# EasyEDA schematic SCH_练习音响_2023-03-02.json
TITLE: Sheet_1; REV: 1.0; Date: 2023-02-19; Sheet: 1/1; Drawn By: CQT-LINFENG; Company: Your Company
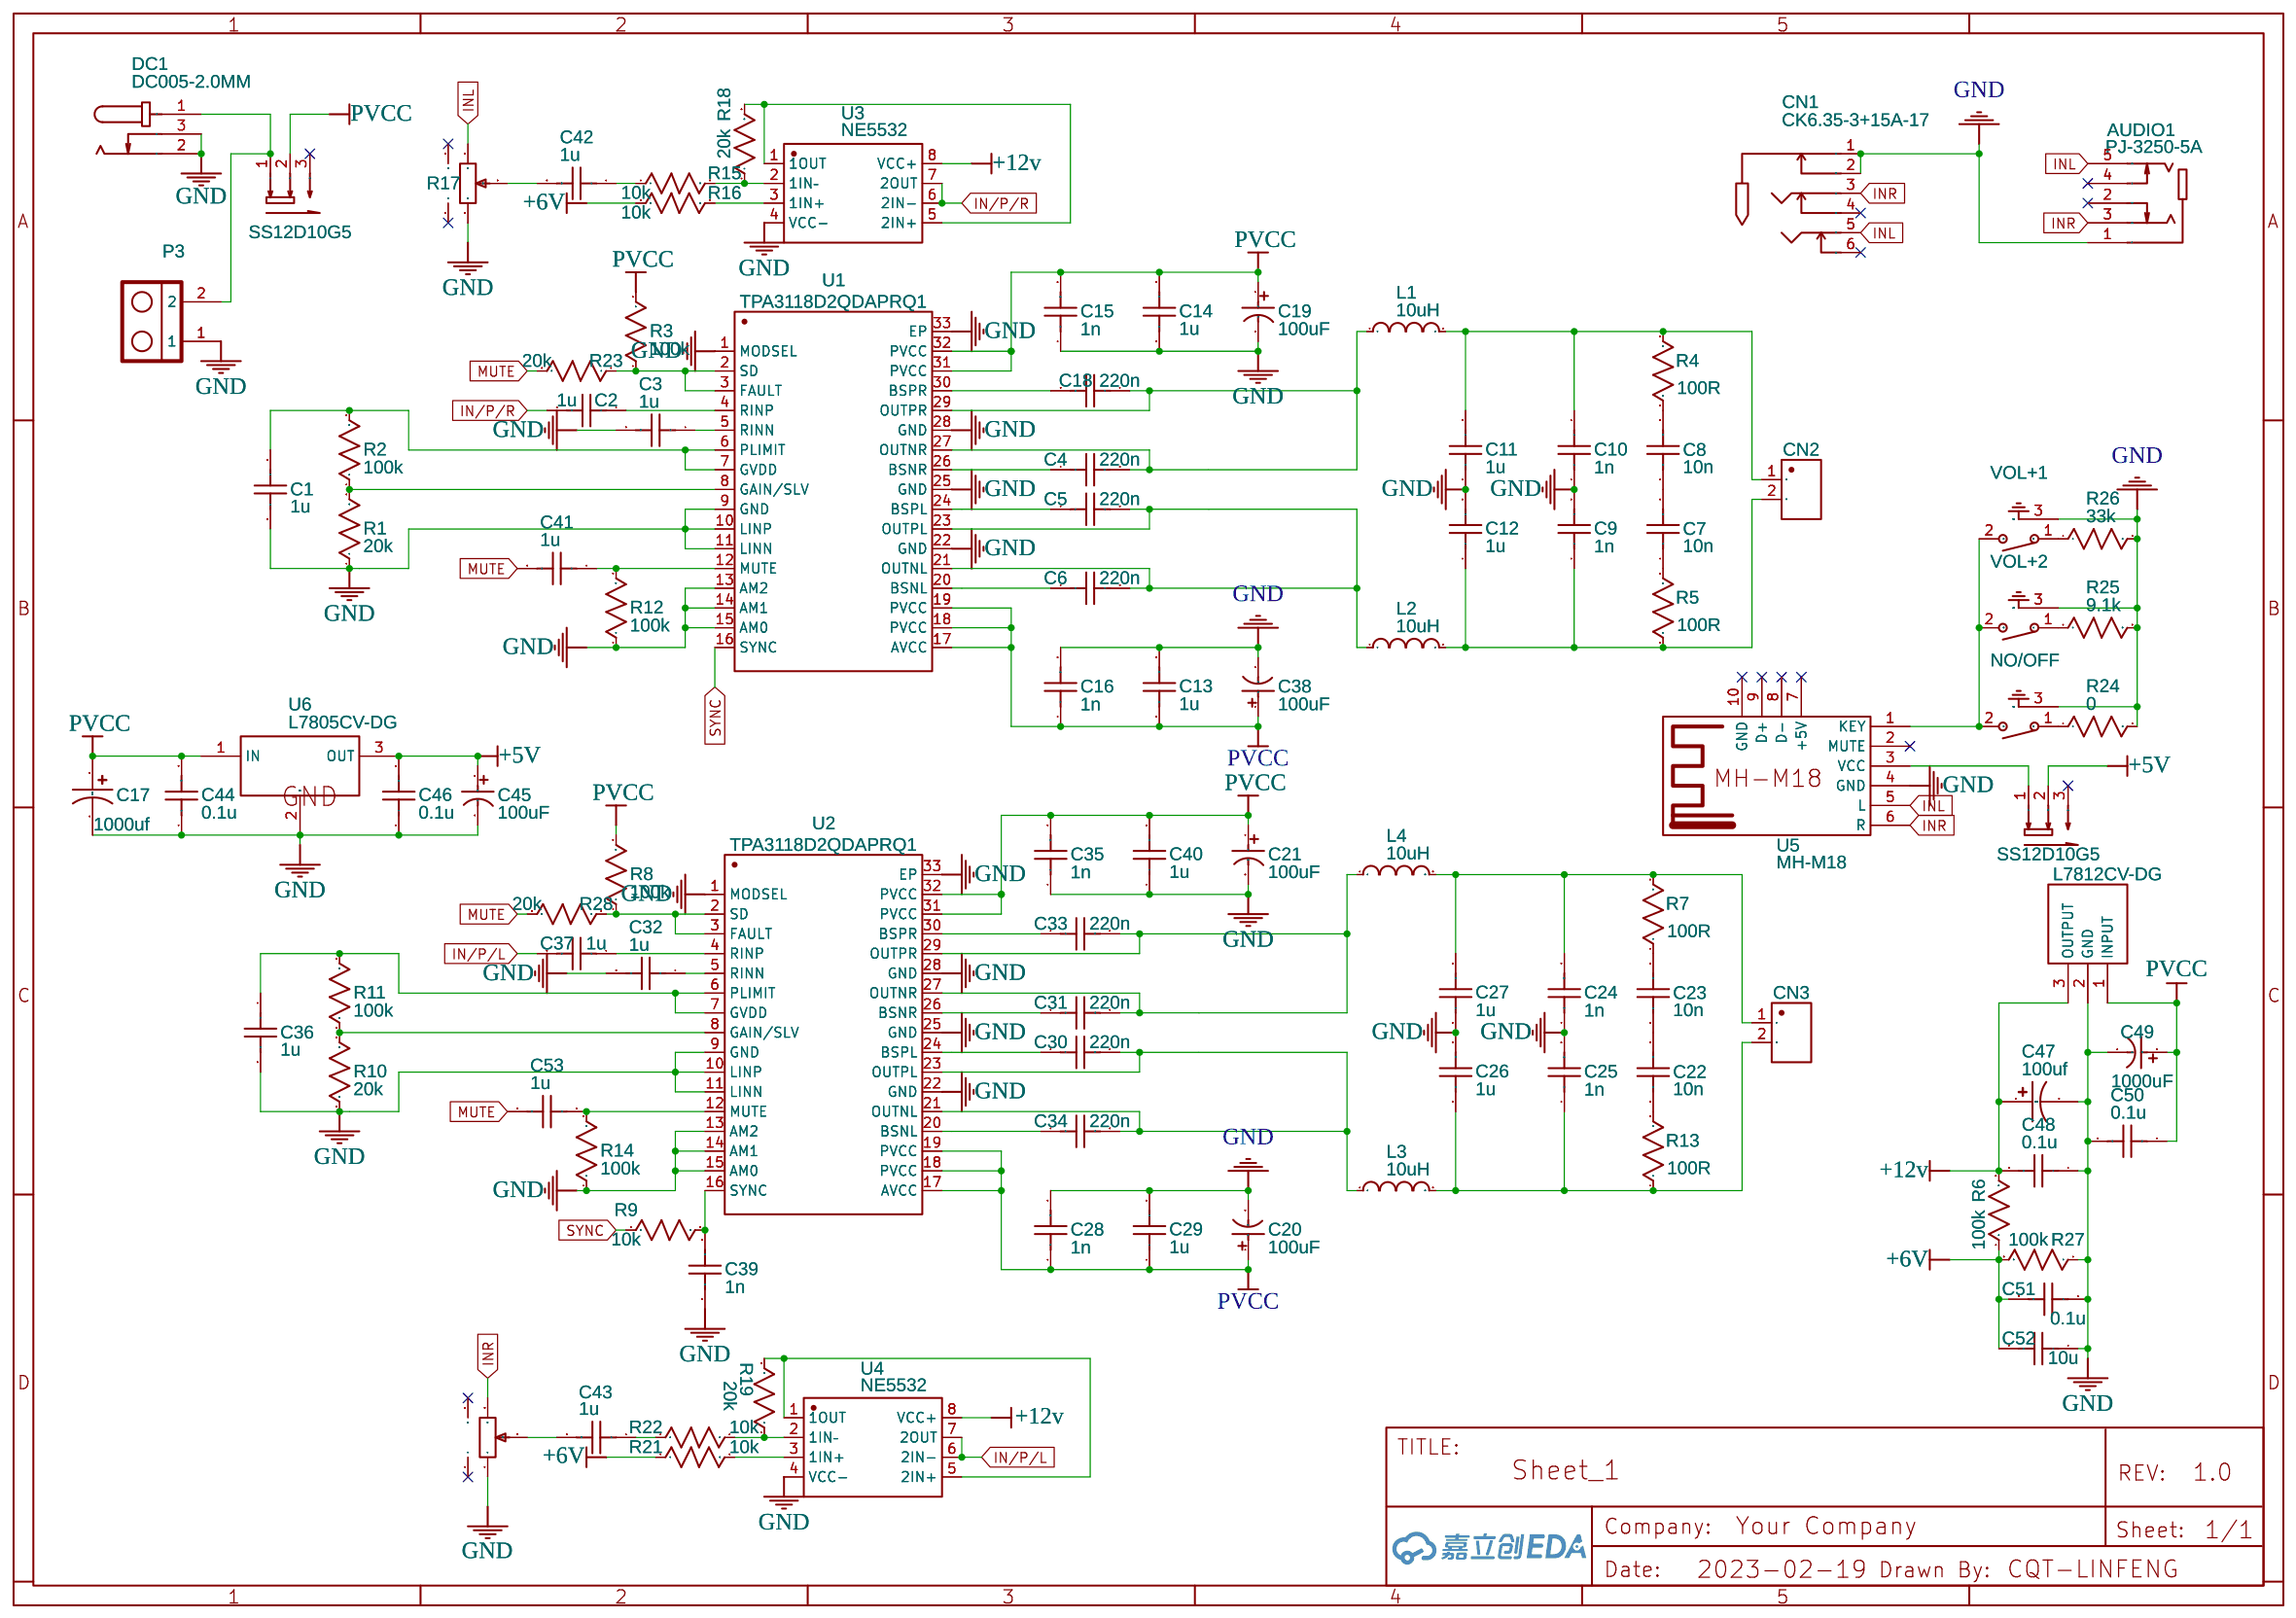
[diagram p0: schematic sheet]

## Parts
AUDIO1  PJ-3250-5A  [AUDIO-TH_PJ-3250-5A]
C1  1u  [C0402]
C2  1u  [C0402]
C3  1u  [C0402]
C4  220n  [C0402]
C5  220n  [C0402]
C6  220n  [C0402]
C7  10n  [C0402]
C8  10n  [C0402]
C9  1n  [C0402]
C10  1n  [C0402]
C11  1u  [C0402]
C12  1u  [C0402]
C13  1u  [C0402]
C14  1u  [C0402]
C15  1n  [C0402]
C16  1n  [C0402]
C17  1000uf  [CAP-D6.3×H5.5]
C18  220n  [C0603]
C19  100uF  [CAP-TH_BD6.3-P2.50-D1.0-FD]
C20  100uF  [CAP-TH_BD6.3-P2.50-D1.0-FD]
C21  100uF  [CAP-TH_BD6.3-P2.50-D1.0-FD]
C22  10n  [C0402]
C23  10n  [C0402]
C24  1n  [C0402]
C25  1n  [C0402]
C26  1u  [C0402]
C27  1u  [C0402]
C28  1n  [C0402]
C29  1u  [C0402]
C30  220n  [C0402]
C31  220n  [C0402]
C32  1u  [C0402]
C33  220n  [C0402]
C34  220n  [C0402]
C35  1n  [C0402]
C36  1u  [C0402]
C37  1u  [C0402]
C38  100uF  [CAP-TH_BD6.3-P2.50-D1.0-FD]
C39  1n  [C0402]
C40  1u  [C0402]
C41  1u  [C0402]
C42  1u  [C0402]
C43  1u  [C0402]
C44  0.1u  [C0402]
C45  100uF  [CAP-TH_BD6.3-P2.50-D1.0-FD]
C46  0.1u  [C0402]
C47  100uf  [CAP-D6.3×H5.5]
C48  0.1u  [C0402]
C49  1000uF  [CAP-TH_BD6.3-P2.50-D1.0-FD]
C50  0.1u  [C0402]
C51  0.1u  [C0402]
C52  10u  [C0402]
C53  1u  [C0402]
CN1  CK6.35-3+15A-17  [AUDIO-TH_CK6.35-3-15A-17]
CN2  A2002WV-2P  [CONN-TH_A2002WV-2P]
CN3  A2002WV-2P  [CONN-TH_A2002WV-2P]
DC1  DC005-2.0MM  [DC-IN-TH_DC005]
L1  10uH  [IND-SMD_L10.4-W10.3]
L2  10uH  [IND-SMD_L10.4-W10.3]
L3  10uH  [IND-SMD_L10.4-W10.3]
L4  10uH  [IND-SMD_L10.4-W10.3]
NO/OFF  侧按键  [侧按键]
P3  端子2P KF128_2  5.08端子-2   PCB端子  [5.08端子-2   PCB端子]
R1  20k  [R0402]
R2  100k  [R0402]
R3  100k  [R0402]
R4  100R  [R0402]
R5  100R  [R0402]
R6  100k  [R0603]
R7  100R  [R0402]
R8  100k  [R0402]
R9  10k  [R0402]
R10  20k  [R0402]
R11  100k  [R0402]
R12  100k  [R0402]
R13  100R  [R0402]
R14  100k  [R0402]
R15  10k  [R0402]
R16  10k  [R0402]
R17  RV09AF-40-15K-B10K-0C  [RES-ADJ-TH_RV09]
R18  20k  [R0402]
R19  20k  [R0402]
R20  RV09AF-40-15K-B10K-0C  [RES-ADJ-TH_RV09]
R21  10k  [R0402]
R22  10k  [R0402]
R23  20k  [R0402]
R24  0  [R0402]
R25  9.1k  [R0402]
R26  33k  [R0402]
R27  100k  [R0603]
R28  20k  [R0402]
SW1  SS12D10G5  [SS12D10G5]
SW2  SS12D10G5  [SS12D10G5]
U1  TPA3118D2QDAPRQ1  [HTSSOP-32_L11.0-W6.1-P0.65-LS8.1-BL-EP]
U2  TPA3118D2QDAPRQ1  [HTSSOP-32_L11.0-W6.1-P0.65-LS8.1-BL-EP]
U3  NE5532  [SOP-8_L4.9-W3.9-P1.27-LS6.0-BL]
U4  NE5532  [SOP-8_L4.9-W3.9-P1.27-LS6.0-BL]
U5  MH-M18  [MH-M18]
U6  L7805CV-DG  [TO-220-3_L10.0-W4.5-P2.54-L]
U7  L7812CV-DG  [TO-220-3_L10.0-W4.5-P2.54-L]
VOL+1  侧按键  [侧按键]
VOL+2  侧按键  [侧按键]

## Library data of the parts
AUDIO1 = PJ-3250-5A: Supplier: LCSC; Supplier Part: C165947; Manufacturer: 韩国韩荣; Contributor: LCSC; JLCPCB Part Class: Extended Part
C1-C16 C22-C37 C39-C44 C46 C48 C50-C53 = C_0402_US: Contributor: LCEDA_Lib
C17 C47 = CE_SMD_D6.3×H5.5_US: Contributor: LCEDA_Lib
C18 = C_0603_US: Contributor: LCEDA_Lib
C19-C21 C38 C45 C49 = 35ZLH100MEFC6.3X11: Supplier: LCSC; Manufacturer: Rubycon; Supplier Part: C109392; JLCPCB Part Class: Extended Part
CN1 = CK6.35-3+15A-17: Supplier: LCSC; Supplier Part: C718061; Manufacturer: JINJIA; Contributor: LCSC; JLCPCB Part Class: Extended Part
CN2 CN3 = A2002WV-2P: Supplier: LCSC; Supplier Part: C273055; Manufacturer: Changjiang Connectors; Contributor: LCSC; JLCPCB Part Class: Extended Part
DC1 = DC005-2.0MM: Supplier: LCSC; Manufacturer: SOFNG; Supplier Part: C111567
L1-L4 = SMDRH104R-100MT: Supplier: LCSC; Manufacturer: SXN; Supplier Part: C9935; JLCPCB Part Class: Extended Part
NO/OFF VOL+1 VOL+2 = 侧按键: Contributor: liyichuangeda
P3 = 端子2P KF128_2  5.08端子-2   PCB端子: Manufacturer Part: 接线端子2P; Contributor: fuxiao7775
R1-R5 R7-R16 R18 R19 R21-R26 R28 = R_0402_US: Contributor: LCEDA_Lib
R6 R27 = R_0603_US: Contributor: LCEDA_Lib
R17 R20 = RV09AF-40-15K-B10K-0C: Supplier: LCSC; Supplier Part: C5151446; Manufacturer: null; Contributor: lcsc; JLCPCB Part Class: Extended Part
SW1 SW2 = SS12D10G5: Supplier: yourcee; Contributor: Pismis24
U1 U2 = TPA3118D2QDAPRQ1: Supplier: LCSC; Supplier Part: C2863787; Manufacturer: TI(德州仪器); Contributor: LCSC
U3 U4 = NE5532: Supplier: LCSC; Supplier Part: C9900016784; Manufacturer: null; JLCPCB Part Class: Extended Part; Contributor: lcsc
U5 = MH-M18: Contributor: 一玮工作室
U6 = L7805CV-DG: Supplier: LCSC; Manufacturer: ST(意法半导体); Supplier Part: C3795; JLCPCB Part Class: Extended Part
U7 = L7812CV-DG: Supplier: LCSC; Manufacturer: ST(意法半导体); Supplier Part: C2914; JLCPCB Part Class: Extended Part

## Nets
+5V: C45.1 C46.2 SW1.2 U6.3(OUT)
+6V: C51.2 C52.2 R6.1 R16.1 R21.1 R27.2
+12v: C47.1 C48.2 R6.2 U3.8(VCC+) U4.8(VCC+) U7.3(OUTPUT)
GND: AUDIO1.1 C1.2 C3.2 C9.2 C10.1 C11.1 C12.2 C13.2 C14.1 C15.1 C16.2 C17.2 C19.2 C20.2 C21.2 C24.1 C25.2 C26.2 C27.1 C28.2 C29.2 C32.2 C35.1 C36.2 C38.2 C39.1 C40.1 C44.1 C45.2 C46.1 C47.2 C48.1 C49.2 C50.2 C51.1 C52.1 CN1.1 CN1.2 DC1.2 DC1.3 NO/OFF.3(GND) P3.1 R1.1 R10.1 R12.1 R14.1 R17.1 R20.1 R24.2 R25.2 R26.2 R27.1 U1.1(MODSEL) U1.9(GND) U1.10(LINP) U1.11(LINN) U1.13(AM2) U1.14(AM1) U1.15(AM0) U1.22(GND) U1.25(GND) U1.28(GND) U1.33(EP) U2.1(MODSEL) U2.9(GND) U2.10(LINP) U2.11(LINN) U2.13(AM2) U2.14(AM1) U2.15(AM0) U2.22(GND) U2.25(GND) U2.28(GND) U2.33(EP) U3.4(VCC-) U4.4(VCC-) U5.4(GND) U6.2(GND) U7.2(GND) VOL+1.3(GND) VOL+2.3(GND)
PVCC: C13.1 C14.2 C15.2 C16.1 C17.1 C19.1 C20.1 C21.1 C28.1 C29.1 C35.2 C38.1 C40.2 C44.2 C49.1 C50.1 R3.2 R8.2 SW2.2 U1.17(AVCC) U1.18(PVCC) U1.19(PVCC) U1.31(PVCC) U1.32(PVCC) U2.17(AVCC) U2.18(PVCC) U2.19(PVCC) U2.31(PVCC) U2.32(PVCC) U6.1(IN) U7.1(INPUT)
IN/P/L: C37.2 U4.6(2IN-) U4.7(2OUT)
IN/P/R: C2.2 U3.6(2IN-) U3.7(2OUT)
INL: AUDIO1.5 CN1.5 R17.3 U5.5(L)
INR: AUDIO1.3 CN1.3 R20.3 U5.6(R)
MUTE: C41.2 C53.2 R23.2 R28.2
SYNC: R9.1 U1.16(SYNC)
Net-(C1-1): C1.1 R2.2 U1.6(PLIMIT) U1.7(GVDD)
Net-(C2-1): C2.1 U1.4(RINP)
Net-(C3-1): C3.1 U1.5(RINN)
Net-(C4-1): C4.1 U1.26(BSNR)
Net-(C4-2): C4.2 C18.1 L1.1 U1.27(OUTNR) U1.29(OUTPR)
Net-(C5-1): C5.1 U1.24(BSPL)
Net-(C5-2): C5.2 C6.2 L2.1 U1.21(OUTNL) U1.23(OUTPL)
Net-(C6-1): C6.1 U1.20(BSNL)
Net-(C7-1): C7.1 R5.2
Net-(C7-2): C7.2 C8.1
Net-(C8-2): C8.2 R4.1
Net-(C9-1): C9.1 C12.1 CN2.2 L2.2 R5.1
Net-(C10-2): C10.2 C11.2 CN2.1 L1.2 R4.2
Net-(C18-2): C18.2 U1.30(BSPR)
Net-(C22-1): C22.1 R13.2
Net-(C22-2): C22.2 C23.1
Net-(C23-2): C23.2 R7.1
Net-(C24-2): C24.2 C27.2 CN3.1 L4.2 R7.2
Net-(C25-1): C25.1 C26.1 CN3.2 L3.2 R13.1
Net-(C30-1): C30.1 U2.24(BSPL)
Net-(C30-2): C30.2 C34.2 L3.1 U2.21(OUTNL) U2.23(OUTPL)
Net-(C31-1): C31.1 U2.26(BSNR)
Net-(C31-2): C31.2 C33.2 L4.1 U2.27(OUTNR) U2.29(OUTPR)
Net-(C32-1): C32.1 U2.5(RINN)
Net-(C33-1): C33.1 U2.30(BSPR)
Net-(C34-1): C34.1 U2.20(BSNL)
Net-(C36-1): C36.1 R11.2 U2.6(PLIMIT) U2.7(GVDD)
Net-(C37-1): C37.1 U2.4(RINP)
Net-(C39-2): C39.2 R9.2 U2.16(SYNC)
Net-(C41-1): C41.1 R12.2 U1.12(MUTE)
Net-(C42-1): C42.1 R15.1
Net-(C42-2): C42.2 R17.2
Net-(C43-1): C43.1 R22.1
Net-(C43-2): C43.2 R20.2
Net-(C53-1): C53.1 R14.2 U2.12(MUTE)
Net-(DC1-1): DC1.1 P3.2 SW2.1
Net-(NO/OFF-1): NO/OFF.1 R24.1
Net-(NO/OFF-2): NO/OFF.2 U5.1(KEY) VOL+1.2 VOL+2.2
Net-(R1-2): R1.2 R2.1 U1.8(GAIN/SLV)
Net-(R3-1): R3.1 R23.1 U1.2(SD) U1.3(FAULT)
Net-(R8-1): R8.1 R28.1 U2.2(SD) U2.3(FAULT)
Net-(R10-2): R10.2 R11.1 U2.8(GAIN/SLV)
Net-(R15-2): R15.2 R18.1 U3.2(1IN–)
Net-(R16-2): R16.2 U3.3(1IN+)
Net-(R18-2): R18.2 U3.1(1OUT) U3.5(2IN+)
Net-(R19-1): R19.1 R22.2 U4.2(1IN–)
Net-(R19-2): R19.2 U4.1(1OUT) U4.5(2IN+)
Net-(R21-2): R21.2 U4.3(1IN+)
Net-(R25-1): R25.1 VOL+2.1
Net-(R26-1): R26.1 VOL+1.1
Net-(SW1-1): SW1.1 U5.3(VCC)

Not connected (* = marked no-connect by the designer): AUDIO1 2* 4*; CN1 4* 6*; R17 4* 5*; R20 4* 5*; SW1 3*; SW2 3*; U5 2(MUTE)* 7(+5V)* 8(D-)* 9(D+)* 10(GND)*
